# EAGLE board K104 (EAGLE 9.2.0), part 1 of 2
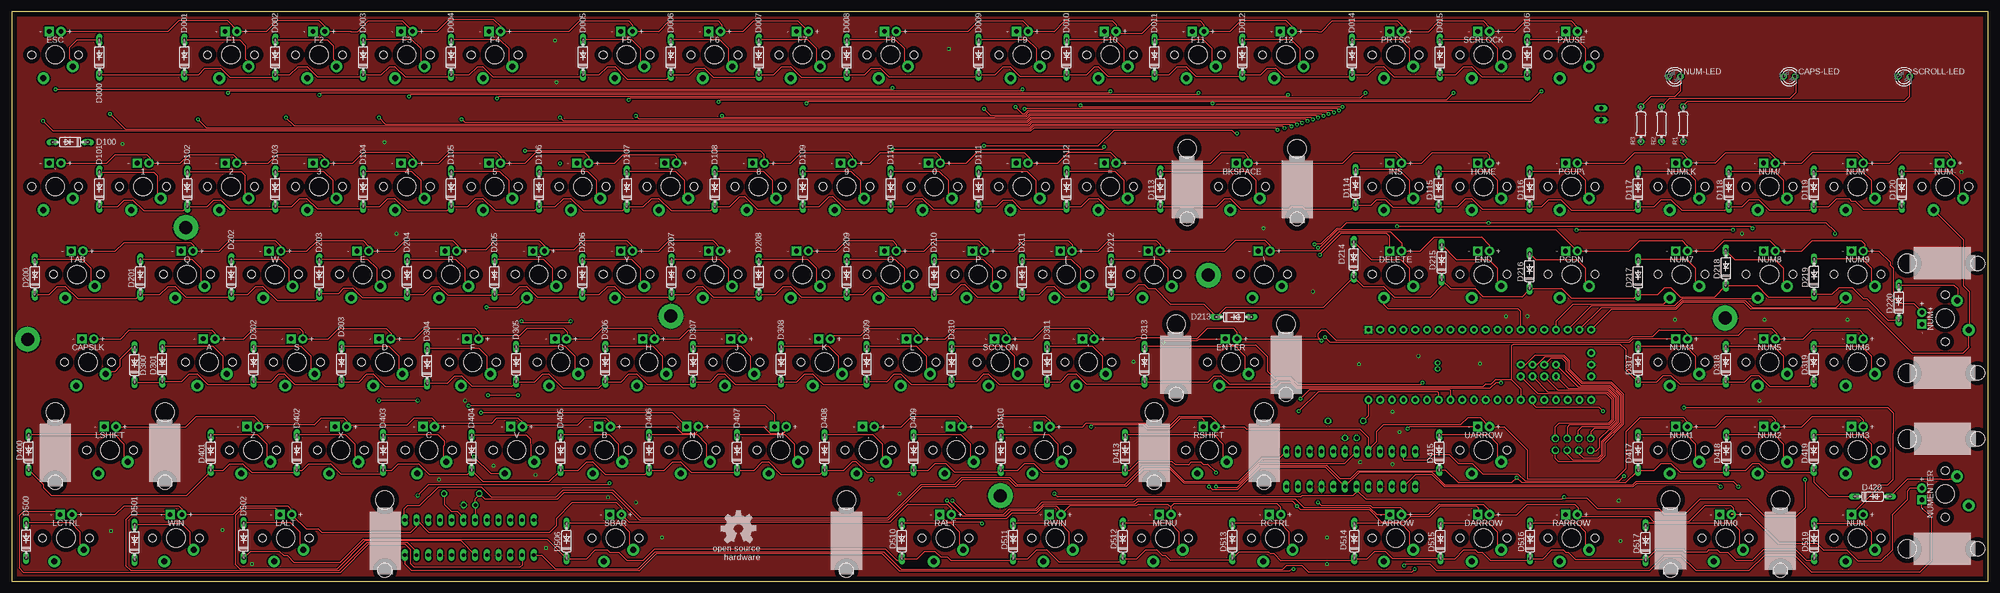
[diagram p2: board, top side]
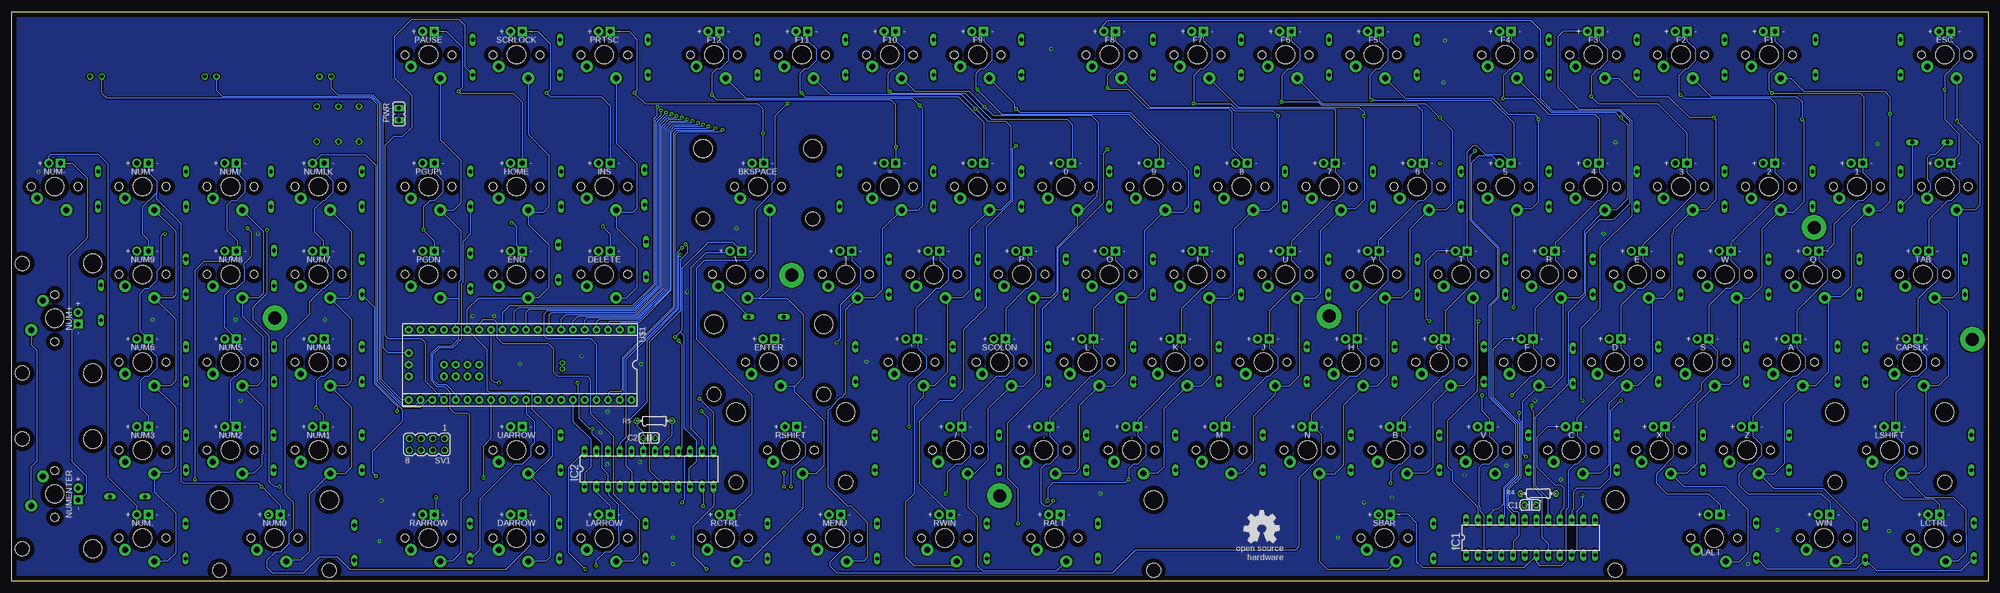
[diagram p3: board, bottom side, seen from below]

Size 428.35 x 123.59 mm. Coordinates in mm from the lower left corner, seen from the top.
Outline: 0,123.59 0,0 428.35,0 428.35,123.59 0,123.59
Copper layers (1*16): Top 0.035mm / dielectric 1.5mm / Bottom 0.035mm
Design rules "default": minimum track width 6mil, minimum drill 0.35mm, track to track 6mil, track to pad 6mil, pad to pad 6mil, via to via 6mil, smd to smd 6mil, copper to edge 40mil, drill to drill 6mil, minimum pad ring 10mil, minimum via ring 8mil, stop-mask expansion 4mil, vias tented up to drill 0mil, thermal gap 10mil
Net classes: 0 default: clearance 0.205 mm

## Footprints (pad centres in the part's own frame; a part is rotated, then mirrored left to right if it is on the bottom)
MX-1U-LED = drill 1 pad 2: LED+ -1.27,-5.08 | drill 1 pad 2 square: LED- 1.27,-5.08 | drill 1.3 pad 2.54: MX1 -3.81,2.54; MX2 2.54,5.08 | hole 4: 0,0 | hole 1.7: -5.08,0; 5.08,0
MX-2U-LED = drill 1 pad 2: LED+ -1.27,-5.08 | drill 1 pad 2 square: LED- 1.27,-5.08 | drill 1.3 pad 2.54: MX1 -3.81,2.54; MX2 2.54,5.08 | hole 4: 0,0; -11.9,-8.24; 11.9,-8.24 | hole 1.7: -5.08,0; 5.08,0 | hole 3.05: -11.9,7; 11.9,7
C025-024X044 = drill 0.813 octagon: 1 -1.27,0; 2 1.27,0
LED3MM = drill 0.813 octagon: A -1.27,0; K 1.27,0
DO35-7 = drill 0.813 long: A 3.81,0; C -3.81,0
2,8-PAD = drill 2.8 pad 5.334: B2,8 0,0
DIL24-3 = drill 0.813 long: 1 -13.97,-3.81; 2 -11.43,-3.81; 3 -8.89,-3.81; 4 -6.35,-3.81; 5 -3.81,-3.81; 6 -1.27,-3.81; 7 1.27,-3.81; 8 3.81,-3.81; 9 6.35,-3.81; 10 8.89,-3.81; 11 11.43,-3.81; 12 13.97,-3.81; 13 13.97,3.81; 14 11.43,3.81; 15 8.89,3.81; 16 6.35,3.81; 17 3.81,3.81; 18 1.27,3.81; 19 -1.27,3.81; 20 -3.81,3.81; 21 -6.35,3.81; 22 -8.89,3.81; 23 -11.43,3.81; 24 -13.97,3.81
JP1 = drill 0.914 long: 1 0,-1.27; 2 0,1.27
0204/7 = drill 0.813 octagon: 1 -3.81,0; 2 3.81,0
MX-6.25U-LED = drill 1 pad 2: LED+ -1.27,-5.08 | drill 1 pad 2 square: LED- 1.27,-5.08 | drill 1.3 pad 2.54: MX1 -3.81,2.54; MX2 2.54,5.08 | hole 4: 0,0; -50,-8.24; 50,-8.24 | hole 1.7: -5.08,0; 5.08,0 | hole 3.05: -50,7; 50,7
MA04-2 = drill 1.016 octagon: 1 -3.81,-1.27; 2 -3.81,1.27; 3 -1.27,-1.27; 4 -1.27,1.27; 5 1.27,-1.27; 6 1.27,1.27; 7 3.81,-1.27; 8 3.81,1.27
TEENSY2.0++ = drill 0.813 pad 1.676: 5V 24.13,-2.54; +5V -24.13,7.62; A0 8.89,2.54; A1 11.43,2.54; A2 13.97,2.54; A3 16.51,2.54; A4 8.89,0; A5 11.43,0; A6 13.97,0; A7 16.51,0; B0 -6.35,7.62; B1 -8.89,7.62; B2 -11.43,7.62; B3 -13.97,7.62; B4 -16.51,7.62; B5 -19.05,7.62; B6 -21.59,7.62; B7 -21.59,-7.62; C0 6.35,-7.62; C1 8.89,-7.62; C2 11.43,-7.62; C3 13.97,-7.62; C4 16.51,-7.62; C5 19.05,-7.62; C6 21.59,-7.62; C7 24.13,-7.62; D0 -19.05,-7.62; D1 -16.51,-7.62; D2 -13.97,-7.62; D3 -11.43,-7.62; D4 -8.89,-7.62; D5 -6.35,-7.62; D6 -3.81,-7.62; D7 -1.27,-7.62; E0 1.27,-7.62; E1 3.81,-7.62; E6 -1.27,7.62; E7 -3.81,7.62; F0 6.35,7.62; F1 8.89,7.62; F2 11.43,7.62; F3 13.97,7.62; F4 16.51,7.62; F5 19.05,7.62; F6 21.59,7.62; F7 24.13,7.62; GND2 24.13,0; GRND1 1.27,7.62; REF 3.81,7.62; RST 24.13,2.54 | drill 0.635 pad 1.067: E4 -9.144,0.914; E5 -9.144,-0.406 | drill 0.813 pad 1.676 square: GND -24.13,-7.62

## Placement (x,y rotation side)
0  KEYSWITCH-LED-MX-1U-LED  [MX-1U-LED]  199.95,85.62 180 top
1  KEYSWITCH-LED-MX-1U-LED  [MX-1U-LED]  28.5,85.62 180 top
2  KEYSWITCH-LED-MX-1U-LED  [MX-1U-LED]  47.55,85.62 180 top
3  KEYSWITCH-LED-MX-1U-LED  [MX-1U-LED]  66.6,85.62 180 top
4  KEYSWITCH-LED-MX-1U-LED  [MX-1U-LED]  85.65,85.62 180 top
5  KEYSWITCH-LED-MX-1U-LED  [MX-1U-LED]  104.7,85.62 180 top
6  KEYSWITCH-LED-MX-1U-LED  [MX-1U-LED]  123.75,85.62 180 top
7  KEYSWITCH-LED-MX-1U-LED  [MX-1U-LED]  142.8,85.62 180 top
8  KEYSWITCH-LED-MX-1U-LED  [MX-1U-LED]  161.85,85.62 180 top
9  KEYSWITCH-LED-MX-1U-LED  [MX-1U-LED]  180.9,85.62 180 top
'  KEYSWITCH-LED-MX-1U-LED  [MX-1U-LED]  233.3,47.52 180 top
,  KEYSWITCH-LED-MX-1U-LED  [MX-1U-LED]  185.65,28.47 180 top
-  KEYSWITCH-LED-MX-1U-LED  [MX-1U-LED]  218.97,85.62 180 top
.  KEYSWITCH-LED-MX-1U-LED  [MX-1U-LED]  204.7,28.47 180 top
/  KEYSWITCH-LED-MX-1U-LED  [MX-1U-LED]  223.75,28.47 180 top
=  KEYSWITCH-LED-MX-1U-LED  [MX-1U-LED]  238.05,85.62 180 top
[  KEYSWITCH-LED-MX-1U-LED  [MX-1U-LED]  228.52,66.57 180 top
\\  KEYSWITCH-LED-MX-1U-LED  [MX-1U-LED]  271.4,66.57 180 top
]  KEYSWITCH-LED-MX-1U-LED  [MX-1U-LED]  247.57,66.57 180 top
`  KEYSWITCH-LED-MX-1U-LED  [MX-1U-LED]  9.45,85.62 180 top
A  KEYSWITCH-LED-MX-1U-LED  [MX-1U-LED]  42.8,47.52 180 top
B  KEYSWITCH-LED-MX-1U-LED  [MX-1U-LED]  128.5,28.47 180 top
BKSPACE  KEYSWITCH-LED-MX-2U-LED  [MX-2U-LED]  266.62,85.62 180 top
C  KEYSWITCH-LED-MX-1U-LED  [MX-1U-LED]  90.4,28.47 180 top
C1  .1μF  [C025-024X044]  99.24,16.56 0 bottom
C2  .1μF  [C025-024X044]  290.19,31.11 0 bottom
CAPS-LED  Caps Lock  [LED3MM]  385.21,109.5 0 top
CAPSLK  KEYSWITCH-LED-MX-1U-LED  [MX-1U-LED]  16.56,47.52 180 top
D  KEYSWITCH-LED-MX-1U-LED  [MX-1U-LED]  80.9,47.52 180 top
D000  1N4148DO35-7  [DO35-7]  19.05,113.67 90 top
D001  1N4148DO35-7  [DO35-7]  37.47,113.67 90 top
D002  1N4148DO35-7  [DO35-7]  57.15,113.67 90 top
D003  1N4148DO35-7  [DO35-7]  76.2,113.67 90 top
D004  1N4148DO35-7  [DO35-7]  95.25,113.67 90 top
D005  1N4148DO35-7  [DO35-7]  123.83,113.67 90 top
D006  1N4148DO35-7  [DO35-7]  142.88,113.67 90 top
D007  1N4148DO35-7  [DO35-7]  161.93,113.67 90 top
D008  1N4148DO35-7  [DO35-7]  180.97,113.67 90 top
D009  1N4148DO35-7  [DO35-7]  209.55,113.67 90 top
D010  1N4148DO35-7  [DO35-7]  228.6,113.67 90 top
D011  1N4148DO35-7  [DO35-7]  247.65,113.67 90 top
D012  1N4148DO35-7  [DO35-7]  266.7,113.67 90 top
D014  1N4148DO35-7  [DO35-7]  290.45,113.67 90 top
D015  1N4148DO35-7  [DO35-7]  309.5,113.67 90 top
D016  1N4148DO35-7  [DO35-7]  328.42,113.67 90 top
D100  1N4148DO35-7  [DO35-7]  12.7,95.25 180 top
D101  1N4148DO35-7  [DO35-7]  19.05,85.09 90 top
D102  1N4148DO35-7  [DO35-7]  38.1,85.09 90 top
D103  1N4148DO35-7  [DO35-7]  57.15,85.09 90 top
D104  1N4148DO35-7  [DO35-7]  76.2,85.09 90 top
D105  1N4148DO35-7  [DO35-7]  95.25,85.09 90 top
D106  1N4148DO35-7  [DO35-7]  114.3,85.09 90 top
D107  1N4148DO35-7  [DO35-7]  133.35,85.09 90 top
D108  1N4148DO35-7  [DO35-7]  152.4,85.09 90 top
D109  1N4148DO35-7  [DO35-7]  171.45,85.09 90 top
D110  1N4148DO35-7  [DO35-7]  190.5,85.09 90 top
D111  1N4148DO35-7  [DO35-7]  209.55,85.09 90 top
D112  1N4148DO35-7  [DO35-7]  228.6,85.09 90 top
D113  1N4148DO35-7  [DO35-7]  248.92,85.09 90 top
D114  1N4148DO35-7  [DO35-7]  291.21,85.47 90 top
D115  1N4148DO35-7  [DO35-7]  309.25,85.09 90 top
D116  1N4148DO35-7  [DO35-7]  328.93,85.09 90 top
D117  1N4148DO35-7  [DO35-7]  352.43,85.09 90 top
D118  1N4148DO35-7  [DO35-7]  372.11,85.09 90 top
D119  1N4148DO35-7  [DO35-7]  390.52,85.09 90 top
D120  1N4148DO35-7  [DO35-7]  409.57,85.09 90 top
D200  1N4148DO35-7  [DO35-7]  5.08,66.04 90 top
D201  1N4148DO35-7  [DO35-7]  27.94,66.04 90 top
D202  1N4148DO35-7  [DO35-7]  47.62,66.04 90 top
D203  1N4148DO35-7  [DO35-7]  66.67,66.04 90 top
D204  1N4148DO35-7  [DO35-7]  85.72,66.04 90 top
D205  1N4148DO35-7  [DO35-7]  104.65,66.04 90 top
D206  1N4148DO35-7  [DO35-7]  123.7,66.04 90 top
D207  1N4148DO35-7  [DO35-7]  143,66.04 90 top
D208  1N4148DO35-7  [DO35-7]  161.93,66.04 90 top
D209  1N4148DO35-7  [DO35-7]  180.97,66.04 90 top
D210  1N4148DO35-7  [DO35-7]  199.9,66.04 90 top
D211  1N4148DO35-7  [DO35-7]  218.95,66.04 90 top
D212  1N4148DO35-7  [DO35-7]  238.25,66.04 90 top
D213  1N4148DO35-7  [DO35-7]  264.85,57.35 0 top
D214  1N4148DO35-7  [DO35-7]  290.83,69.85 90 top
D215  1N4148DO35-7  [DO35-7]  309.88,69.22 90 top
D216  1N4148DO35-7  [DO35-7]  328.93,67.31 90 top
D217  1N4148DO35-7  [DO35-7]  352.43,66.04 90 top
D218  1N4148DO35-7  [DO35-7]  371.48,67.94 90 top
D219  1N4148DO35-7  [DO35-7]  390.58,66.09 90 top
D220  1N4148DO35-7  [DO35-7]  408.94,60.45 90 top
D300  1N4148DO35-7  [DO35-7]  26.67,46.99 90 top
D301  1N4148DO35-7  [DO35-7]  32.66,47.14 90 top
D302  1N4148DO35-7  [DO35-7]  52.45,47.12 90 top
D303  1N4148DO35-7  [DO35-7]  71.5,47.12 90 top
D304  1N4148DO35-7  [DO35-7]  90.04,46.74 90 top
D305  1N4148DO35-7  [DO35-7]  109.35,47.12 90 top
D306  1N4148DO35-7  [DO35-7]  128.65,47.12 90 top
D307  1N4148DO35-7  [DO35-7]  147.7,47.12 90 top
D308  1N4148DO35-7  [DO35-7]  166.75,47.12 90 top
D309  1N4148DO35-7  [DO35-7]  185.29,47.12 90 top
D310  1N4148DO35-7  [DO35-7]  203.71,47.12 90 top
D311  1N4148DO35-7  [DO35-7]  224.41,47.12 90 top
D313  1N4148DO35-7  [DO35-7]  245.49,47.12 90 top
D317  1N4148DO35-7  [DO35-7]  352.43,47.12 90 top
D318  1N4148DO35-7  [DO35-7]  371.48,47.12 90 top
D319  1N4148DO35-7  [DO35-7]  390.52,47.12 90 top
D400  1N4148DO35-7  [DO35-7]  3.71,27.97 90 top
D401  1N4148DO35-7  [DO35-7]  43.18,27.94 90 top
D402  1N4148DO35-7  [DO35-7]  61.85,27.94 90 top
D403  1N4148DO35-7  [DO35-7]  80.52,27.94 90 top
D404  1N4148DO35-7  [DO35-7]  99.69,27.94 90 top
D405  1N4148DO35-7  [DO35-7]  118.97,27.94 90 top
D406  1N4148DO35-7  [DO35-7]  138.15,27.94 90 top
D407  1N4148DO35-7  [DO35-7]  157.23,27.94 90 top
D408  1N4148DO35-7  [DO35-7]  176.15,27.94 90 top
D409  1N4148DO35-7  [DO35-7]  195.45,27.94 90 top
D410  1N4148DO35-7  [DO35-7]  214.38,27.94 90 top
D413  1N4148DO35-7  [DO35-7]  241.3,27.94 90 top
D415  1N4148DO35-7  [DO35-7]  309.37,27.94 90 top
D417  1N4148DO35-7  [DO35-7]  352.43,27.94 90 top
D418  1N4148DO35-7  [DO35-7]  371.55,27.94 90 top
D419  1N4148DO35-7  [DO35-7]  390.52,27.94 90 top
D420  1N4148DO35-7  [DO35-7]  403.23,18.41 0 top
D500  1N4148DO35-7  [DO35-7]  3.17,8.89 90 top
D501  1N4148DO35-7  [DO35-7]  26.67,8.51 90 top
D502  1N4148DO35-7  [DO35-7]  50.29,8.89 90 top
D506  1N4148DO35-7  [DO35-7]  120.27,8.76 90 top
D510  1N4148DO35-7  [DO35-7]  192.91,8.76 90 top
D511  1N4148DO35-7  [DO35-7]  217.04,8.76 90 top
D512  1N4148DO35-7  [DO35-7]  240.79,8.76 90 top
D513  1N4148DO35-7  [DO35-7]  264.54,8.76 90 top
D514  1N4148DO35-7  [DO35-7]  290.96,8.76 90 top
D515  1N4148DO35-7  [DO35-7]  309.63,8.76 90 top
D516  1N4148DO35-7  [DO35-7]  329.06,8.76 90 top
D517  1N4148DO35-7  [DO35-7]  354.08,8.38 90 top
D519  1N4148DO35-7  [DO35-7]  390.6,8.76 90 top
DARROW  KEYSWITCH-LED-MX-1U-LED  [MX-1U-LED]  318.95,9.42 180 top
DELETE  KEYSWITCH-LED-MX-1U-LED  [MX-1U-LED]  299.9,66.57 180 top
E  KEYSWITCH-LED-MX-1U-LED  [MX-1U-LED]  76.12,66.57 180 top
END  KEYSWITCH-LED-MX-1U-LED  [MX-1U-LED]  318.95,66.57 180 top
ENTER  KEYSWITCH-LED-MX-2U-LED  [MX-2U-LED]  264.24,47.52 180 top
ESC  S001  [MX-1U-LED]  9.45,114.2 180 top
F  KEYSWITCH-LED-MX-1U-LED  [MX-1U-LED]  99.95,47.52 180 top
F1  KEYSWITCH-LED-MX-1U-LED  [MX-1U-LED]  47.55,114.2 180 top
F2  KEYSWITCH-LED-MX-1U-LED  [MX-1U-LED]  66.6,114.2 180 top
F3  KEYSWITCH-LED-MX-1U-LED  [MX-1U-LED]  85.65,114.2 180 top
F4  KEYSWITCH-LED-MX-1U-LED  [MX-1U-LED]  104.7,114.2 180 top
F5  KEYSWITCH-LED-MX-1U-LED  [MX-1U-LED]  133.27,114.2 180 top
F6  KEYSWITCH-LED-MX-1U-LED  [MX-1U-LED]  152.32,114.2 180 top
F7  KEYSWITCH-LED-MX-1U-LED  [MX-1U-LED]  171.37,114.2 180 top
F8  KEYSWITCH-LED-MX-1U-LED  [MX-1U-LED]  190.42,114.2 180 top
F9  KEYSWITCH-LED-MX-1U-LED  [MX-1U-LED]  219,114.2 180 top
F10  KEYSWITCH-LED-MX-1U-LED  [MX-1U-LED]  238.05,114.2 180 top
F11  KEYSWITCH-LED-MX-1U-LED  [MX-1U-LED]  257.1,114.2 180 top
F12  KEYSWITCH-LED-MX-1U-LED  [MX-1U-LED]  276.15,114.2 180 top
G  KEYSWITCH-LED-MX-1U-LED  [MX-1U-LED]  119,47.52 180 top
H  KEYSWITCH-LED-MX-1U-LED  [MX-1U-LED]  138.05,47.52 180 top
H1  MOUNT-PAD-ROUND2.8  [2,8-PAD]  3.48,52.5 0 top
H2  MOUNT-PAD-ROUND2.8  [2,8-PAD]  37.77,76.78 0 top
H3  MOUNT-PAD-ROUND2.8  [2,8-PAD]  142.88,57.53 0 top
H4  MOUNT-PAD-ROUND2.8  [2,8-PAD]  214.25,18.59 0 top
H5  MOUNT-PAD-ROUND2.8  [2,8-PAD]  259.31,66.42 0 top
H6  MOUNT-PAD-ROUND2.8  [2,8-PAD]  371.27,57.12 0 top
HOME  KEYSWITCH-LED-MX-1U-LED  [MX-1U-LED]  318.95,85.62 180 top
I  KEYSWITCH-LED-MX-1U-LED  [MX-1U-LED]  171.37,66.57 180 top
IC1  MAX7219CNG  [DIL24-3]  99.19,9.53 0 bottom
IC2  MAX7219CNG  [DIL24-3]  290.19,24.38 0 bottom
INS  KEYSWITCH-LED-MX-1U-LED  [MX-1U-LED]  299.9,85.62 180 top
J  KEYSWITCH-LED-MX-1U-LED  [MX-1U-LED]  157.1,47.52 180 top
K  KEYSWITCH-LED-MX-1U-LED  [MX-1U-LED]  176.15,47.52 180 top
L  KEYSWITCH-LED-MX-1U-LED  [MX-1U-LED]  195.2,47.52 180 top
LALT  KEYSWITCH-LED-MX-1U-LED  [MX-1U-LED]  59.44,9.42 180 top
LARROW  KEYSWITCH-LED-MX-1U-LED  [MX-1U-LED]  299.9,9.42 180 top
LCTRL  KEYSWITCH-LED-MX-1U-LED  [MX-1U-LED]  11.81,9.42 180 top
LSHIFT  KEYSWITCH-LED-MX-2U-LED  [MX-2U-LED]  21.36,28.47 180 top
M  KEYSWITCH-LED-MX-1U-LED  [MX-1U-LED]  166.6,28.47 180 top
MENU  KEYSWITCH-LED-MX-1U-LED  [MX-1U-LED]  249.94,9.42 180 top
N  KEYSWITCH-LED-MX-1U-LED  [MX-1U-LED]  147.55,28.47 180 top
NUM0  KEYSWITCH-LED-MX-2U-LED  [MX-2U-LED]  371.37,9.42 180 top
NUM1  KEYSWITCH-LED-MX-1U-LED  [MX-1U-LED]  361.85,28.47 180 top
NUM2  KEYSWITCH-LED-MX-1U-LED  [MX-1U-LED]  380.9,28.47 180 top
NUM3  KEYSWITCH-LED-MX-1U-LED  [MX-1U-LED]  399.95,28.47 180 top
NUM4  KEYSWITCH-LED-MX-1U-LED  [MX-1U-LED]  361.85,47.52 180 top
NUM5  KEYSWITCH-LED-MX-1U-LED  [MX-1U-LED]  380.9,47.52 180 top
NUM6  KEYSWITCH-LED-MX-1U-LED  [MX-1U-LED]  399.95,47.52 180 top
NUM7  KEYSWITCH-LED-MX-1U-LED  [MX-1U-LED]  361.85,66.57 180 top
NUM8  KEYSWITCH-LED-MX-1U-LED  [MX-1U-LED]  380.9,66.57 180 top
NUM9  KEYSWITCH-LED-MX-1U-LED  [MX-1U-LED]  399.95,66.57 180 top
NUM*  KEYSWITCH-LED-MX-1U-LED  [MX-1U-LED]  399.95,85.62 180 top
NUM+  KEYSWITCH-LED-MX-2U-LED  [MX-2U-LED]  419,57.07 270 top
NUM-  KEYSWITCH-LED-MX-1U-LED  [MX-1U-LED]  419,85.62 180 top
NUM-LED  Num Lock  [LED3MM]  360.36,109.5 0 top
NUM.  KEYSWITCH-LED-MX-1U-LED  [MX-1U-LED]  399.95,9.42 180 top
NUM/  KEYSWITCH-LED-MX-1U-LED  [MX-1U-LED]  380.9,85.62 180 top
NUMENTER  KEYSWITCH-LED-MX-2U-LED  [MX-2U-LED]  419,18.97 270 top
NUMLK  KEYSWITCH-LED-MX-1U-LED  [MX-1U-LED]  361.85,85.62 180 top
O  KEYSWITCH-LED-MX-1U-LED  [MX-1U-LED]  190.42,66.57 180 top
P  KEYSWITCH-LED-MX-1U-LED  [MX-1U-LED]  209.47,66.57 180 top
PAUSE  KEYSWITCH-LED-MX-1U-LED  [MX-1U-LED]  338,114.2 180 top
PGDN  KEYSWITCH-LED-MX-1U-LED  [MX-1U-LED]  338,66.57 180 top
PGUP\  KEYSWITCH-LED-MX-1U-LED  [MX-1U-LED]  338,85.62 180 top
PRTSC  KEYSWITCH-LED-MX-1U-LED  [MX-1U-LED]  299.9,114.2 180 top
PWR  [JP1]  344.42,101.35 0 bottom
Q  KEYSWITCH-LED-MX-1U-LED  [MX-1U-LED]  38.02,66.57 180 top
R  KEYSWITCH-LED-MX-1U-LED  [MX-1U-LED]  95.17,66.57 180 top
R1  100~Ω  [0204/7]  362.2,99.19 90 top
R2  100~Ω  [0204/7]  357.5,99.19 90 top
R3  100~Ω  [0204/7]  353.06,99.19 90 top
R4  9KΩ  [0204/7]  97.54,19.05 0 bottom
R5  9KΩ  [0204/7]  289.05,34.8 0 bottom
RALT  KEYSWITCH-LED-MX-1U-LED  [MX-1U-LED]  202.36,9.42 180 top
RARROW  KEYSWITCH-LED-MX-1U-LED  [MX-1U-LED]  338,9.42 180 top
RCTRL  KEYSWITCH-LED-MX-1U-LED  [MX-1U-LED]  273.76,9.42 180 top
RSHIFT  KEYSWITCH-LED-MX-2U-LED  [MX-2U-LED]  259.49,28.47 180 top
RWIN  KEYSWITCH-LED-MX-1U-LED  [MX-1U-LED]  226.14,9.42 180 top
S  KEYSWITCH-LED-MX-1U-LED  [MX-1U-LED]  61.85,47.52 180 top
SBAR  KEYSWITCH-LED-MX-6.25U-LED  [MX-6.25U-LED]  130.89,9.42 180 top
SCOLON  KEYSWITCH-LED-MX-1U-LED  [MX-1U-LED]  214.25,47.52 180 top
SCRLOCK  KEYSWITCH-LED-MX-1U-LED  [MX-1U-LED]  318.95,114.2 180 top
SCROLL-LED  Scroll Lock  [LED3MM]  410.05,109.5 0 top
SV1  [MA04-2]  338.33,29.72 180 bottom
T  KEYSWITCH-LED-MX-1U-LED  [MX-1U-LED]  114.22,66.57 180 top
TAB  KEYSWITCH-LED-MX-1U-LED  [MX-1U-LED]  14.2,66.57 180 top
U  KEYSWITCH-LED-MX-1U-LED  [MX-1U-LED]  152.32,66.57 180 top
U$1  TEENSY2.0++  [TEENSY2.0++]  318.13,46.99 180 bottom
U$2  [OSHW_8MM]  157.48,11.43 0 bottom
U$3  [OSHW_8MM]  157.48,11.43 0 top
UARROW  KEYSWITCH-LED-MX-1U-LED  [MX-1U-LED]  318.95,28.47 180 top
V  KEYSWITCH-LED-MX-1U-LED  [MX-1U-LED]  109.45,28.47 180 top
W  KEYSWITCH-LED-MX-1U-LED  [MX-1U-LED]  57.07,66.57 180 top
WIN  KEYSWITCH-LED-MX-1U-LED  [MX-1U-LED]  35.64,9.42 180 top
X  KEYSWITCH-LED-MX-1U-LED  [MX-1U-LED]  71.35,28.47 180 top
Y  KEYSWITCH-LED-MX-1U-LED  [MX-1U-LED]  133.27,66.57 180 top
Z  KEYSWITCH-LED-MX-1U-LED  [MX-1U-LED]  52.3,28.47 180 top

## Tracks (layer width: path | path; a pad name or v marks a point on that pad's centre or on a via)
A0
  Top 0.152: U$1.A0 330.71,40.77 345.57,40.77 346.71,39.62 346.71,35.05 345.95,34.29 335.28,34.29 334.52,33.53 SV1.1
A1
  Top 0.152: U$1.A1 332.89,41.12 345.71,41.12 347.07,39.77 347.07,36.6 347.09,36.58 347.07,36.55 347.07,34.9 346.07,33.91 337.57,33.91 337.06,33.4 SV1.3
A2
  Top 0.152: U$1.A2 335.07,41.48 345.86,41.48 347.45,39.9 347.45,34.78 346.22,33.55 340.26,33.55 339.47,32.77 339.47,31.11 SV1.5
A3
  Top 0.152: U$1.A3 337.26,41.84 346.01,41.84 347.81,40.05 347.81,34.63 346.37,33.19 342.95,33.19 342.14,32.38 SV1.7
A4
  Top 0.152: U$1.A4 327.98,46.99 330.09,49.1 336.34,49.1 337.52,47.92 337.52,46.13 340.38,43.27 346.6,43.27 349.24,40.64 349.24,34.04 345.19,29.99 345.19,27.18 343.91,25.91 335.28,25.91 334.52,26.67 SV1.2
A5
  Top 0.152: U$1.A5 330.52,46.99 332.28,48.74 336.19,48.74 337.16,47.77 337.16,45.98 340.23,42.91 346.45,42.91 348.88,40.49 348.88,34.19 344.81,30.11 344.81,27.31 343.79,26.29 338.33,26.29 337.06,27.56 SV1.4
A6
  Top 0.152: U$1.A6 333.5,48.39 336.04,48.39 336.8,47.62 336.8,45.72 339.97,42.55 346.31,42.55 348.52,40.34 348.52,34.34 344.42,30.24 344.42,27.43 343.66,26.67 340.61,26.67 339.6,27.69 SV1.6
A7
  Top 0.152: U$1.A7 339.44,42.2 346.16,42.2 348.16,40.19 348.16,34.48 346.52,32.84 346.02,32.84 344.04,30.86 344.04,28.96 343.28,28.19 342.39,28.19 SV1.8
B0  (via drill 0.35)
  Top 0.152: IC2.13 274.7,26.67 270.89,26.67 265.94,21.72 254.13,21.72 250.99,24.85 245.07,24.85 241.17,20.95 217.93,20.95 216.41,22.48 205.74,22.48 204.22,20.95 196.98,20.95 189.8,13.78 136.38,13.78 130.4,19.76 119.41,19.76 117.91,18.26 104.04,18.26 101.85,20.45 92.46,20.45 88.39,16.38 85.72,16.38 84.96,15.62 84.96,13.59 IC1.13 | U$1.B0 311.79,41.4 311.66,41.53 281.18,41.53 v279.27,39.62
  Bottom 0.152: IC2.13 276.23,36.58 v279.27,39.62
B1  (via drill 0.35)
  Top 0.152: IC1.12 85.22,3.81 86.74,2.29 136.02,2.29 139.72,5.99 188.65,5.99 192.46,2.18 276.88,2.18 277.37,2.67 v277.75,2.67 | U$1.B1 309.25,40.89 308.99,41.15 283.08,41.15 v278.89,36.96
  Bottom 0.152: v277.75,2.67 280.8,5.71 280.8,11.81 276.23,16.38 IC2.12 277.37,21.72 277.37,35.43 v278.89,36.96
B2
  Bottom 0.152: U$1.B2 306.7,34.67 302.89,30.86 302.89,24.77 304.17,23.5 IC2.1
B5  (via drill 0.35)
  Top 0.152: v275.84,98.3 275.46,98.68 221.35,98.68 220.63,97.96 24.72,97.96 v21.34,101.35
  Bottom 0.152: 1.MX2 26.2,80.3 | 26.2,80.3 29.72,76.78 29.72,64.01 32,61.72 35.26,61.72 Q.MX2 34.72,60.73 34.72,45.29 37.57,42.44 A.MX2 44.2,38.51 44.2,25.53 46.48,23.24 49.91,23.24 Z.MX2 46.56,20.19 35.81,20.19 28.57,12.95 28.57,5.33 30.1,3.81 32.56,3.81 WIN.MX2 | F1.MX2 42.82,109.12 40.01,106.3 22.48,106.3 21.34,105.16 v21.34,101.35 21.34,82.3 23.33,80.3 26.2,80.3 | v275.84,98.3 276.23,97.92 284.18,97.92 284.99,97.1 284.99,59.56 296.04,48.51 296.04,41.53 296.42,41.15 298.7,41.15 299.08,40.77 U$1.B5
B6  (via drill 0.35)
  Top 0.152: v274.32,97.92 273.94,98.3 221.47,98.3 220.78,97.61 9.07,97.61 v6.86,99.82
  Bottom 0.152: LCTRL.MX2 6.71,4.34 4.79,6.26 4.79,10.23 4.95,10.39 4.95,15.62 7.62,18.29 13.72,18.29 LSHIFT.MX2 15.09,23.39 13.64,24.84 13.64,42.06 CAPSLK.MX2 10.9,42.44 8.76,44.58 8.76,58.6 TAB.MX2 7.85,61.49 6.53,62.81 6.53,80.16 `.MX2 2.9,80.54 1.91,81.53 1.91,94.87 v6.86,99.82 6.86,109.07 ESC.MX2 | v274.32,97.92 274.7,97.54 283.9,97.54 284.61,96.83 284.61,59.44 295.66,48.39 295.66,40.77 296.55,39.88 U$1.B6
B7  (via drill 0.35)
  Top 0.152: v277.37,98.68 276.99,99.06 221.22,99.06 220.48,98.32 42.27,98.32 v40.39,100.2
  Bottom 0.152: LALT.MX2 56.74,4.19 54.1,4.19 52.2,6.1 52.2,15.62 57.15,20.57 65.99,20.57 X.MX2 65.38,23.39 63.25,25.53 63.25,38.51 S.MX2 59.08,42.67 56.01,42.67 54.15,44.53 54.15,61.34 | W.MX2 54.53,61.34 54.15,61.34 | 54.15,61.34 51.82,61.34 49.15,64.01 49.15,76.4 2.MX2 44.48,80.01 42.29,80.01 40.01,82.3 40.01,99.82 v40.39,100.2 40.39,104.01 41.53,105.16 60.1,105.16 F2.MX2 | v277.37,98.68 277.75,98.3 284.48,98.3 285.37,97.41 285.37,63.15 292.37,56.15 296.28,56.15 296.55,55.88 U$1.B7
C0  (via drill 0.35)
  Top 0.152: ENTER.MX2 262.08,42.06 273.97,42.06 275.05,43.14 277.22,43.14 278.45,41.91 320.42,41.91 321.56,43.05 v322.71,43.05
  Bottom 0.152: BKSPACE.MX2 264.08,63.58 266.32,61.34 | 266.32,61.34 268.71,61.34 \\.MX2 | 266.32,61.34 260.22,61.34 256.79,57.91 256.79,44.2 258.7,42.29 | 258.7,42.29 261.54,42.29 ENTER.MX2 | 258.7,42.29 258.7,41.15 252.22,34.67 252.22,25.15 253.97,23.39 RSHIFT.MX2 256.95,15.85 268.45,4.34 RCTRL.MX2 | U$1.C0 324.49,43.94 323.85,43.31 322.96,43.31 v322.71,43.05
C1
  Top 0.152: U$1.C1 327.02,58.55 326.52,59.05 298.32,59.05 297.36,60.02 DELETE.MX2
  Bottom 0.152: PRTSC.MX2 297.36,95.05 292.88,90.56 292.88,80.89 293.75,80.01 297.18,80.01 297.36,80.19 INS.MX2 297.36,76.76 292.88,72.28 292.88,63.74 295.27,61.34 297.2,61.34 DELETE.MX2 | U$1.C1 327.02,55.88 326.14,56.77 323.85,56.77 323.24,56.16 323.24,52.86 321.94,51.56 312.04,51.56 310.9,50.42 310.9,45.34 310.13,44.58 303.66,44.58 302.92,43.84 302.92,36.47 297.94,31.5 297.94,19.05 292.29,13.4 292.29,5.78 293.72,4.34 LARROW.MX2
C2
  Bottom 0.152: SCRLOCK.MX2 316.41,96.95 311.93,92.47 311.93,81.27 313.18,80.01 315.87,80.01 HOME.MX2 316.41,77.52 311.93,73.04 311.93,63.74 314.17,61.49 END.MX2 327.13,61.49 329.56,59.05 U$1.C2 325.37,50.42 325.37,41.53 324.99,41.15 316.23,41.15 315.6,40.51 315.6,37.47 311.16,33.03 311.16,27.16 314.94,23.39 UARROW.MX2 311.66,18.64 311.66,5.33 312.65,4.34 DARROW.MX2
C3
  Bottom 0.152: PAUSE.MX2 335.46,95.81 330.98,91.33 330.98,82.03 332.61,80.39 335.31,80.39 PGUP\.MX2 330.98,76.06 330.98,65.39 331.47,64.89 331.47,61.34 | RARROW.MX2 332.84,4.34 330.98,6.21 330.98,17.64 329.18,19.43 329.18,36.2 329.56,36.58 332.41,36.58 333.37,37.53 333.37,41.15 334.54,42.31 336.19,42.31 337.54,43.67 337.54,49.3 335.79,51.05 332.99,51.05 331.47,52.58 331.47,53.98 U$1.C3 332.3,54.8 332.3,55.56 331.47,56.39 331.47,61.34 | PGDN.MX2 335.31,61.34 331.47,61.34
C4
  Top 0.152: U$1.C4 334.64,56.52 338.33,60.2 358.01,60.2 NUM7.MX2
  Bottom 0.152: NUMLK.MX2 354.71,75.95 354.71,62.1 355.47,61.34 359.16,61.34 NUM7.MX2 354.71,56.9 354.71,43.43 355.7,42.44 NUM4.MX2 354.71,37.85 354.71,24.77 356.15,23.33 359.37,23.33 | NUM1.MX2 359.37,23.33 | 359.37,23.33 363.86,18.85 363.86,6.48 365.76,4.57 367.67,4.57 368.05,4.95 368.22,4.95 NUM0.MX2
C5
  Top 0.152: U$1.C5 342.39,59.82 360.43,59.82 361.95,61.34 378.21,61.34 NUM8.MX2
  Bottom 0.152: NUM/.MX2 373.76,75.95 373.76,62.48 374.75,61.49 NUM8.MX2 378.36,57.56 373.88,53.07 373.88,43.7 375.13,42.44 NUM5.MX2 373.88,37.96 373.88,27.67 374.14,27.4 374.14,25.15 375.89,23.39 NUM2.MX2
C6
  Top 0.152: U$1.C6 344.57,59.46 360.57,59.46 362.07,60.96 375.67,60.96 377.19,59.44 395.35,59.44 NUM9.MX2
  Bottom 0.152: NUM*.MX2 392.81,75.95 392.81,62.1 393.42,61.49 NUM9.MX2 392.81,56.9 392.81,43.43 393.8,42.44 NUM6.MX2 392.81,37.85 392.81,24.77 393.95,23.62 397.18,23.62 NUM3.MX2 397.41,19.46 392.81,14.86 392.81,6.1 394.56,4.34 NUM..MX2
C7
  Top 0.152: U$1.C7 346.76,59.1 360.72,59.1 362.2,60.58 375.29,60.58 376.81,59.05 402.34,59.05 411.86,49.53 422.91,49.53 424.18,50.8 424.08,50.9 NUM+.MX2 | NUM-.MX2 422.91,74.09 422.91,64.14 424.18,62.87 424.18,54.63 NUM+.MX2 | NUM+.MX2 423.53,53.98
  Bottom 0.152: NUM+.MX2 424.08,51.33 422.91,50.16 422.91,26.04 424.18,24.77 424.18,16.54 NUMENTER.MX2
D0  (via drill 0.35)
  Top 0.152: v278.51,99.06 278.13,99.44 221.1,99.44 220.38,98.73 81.58,98.73 81.53,98.68 61.34,98.68 v59.44,100.58
  Bottom 0.152: E.MX2 73.58,61.34 72.82,61.34 | 72.82,61.34 72.82,45.67 76.05,42.44 D.MX2 82.3,38.51 82.3,25.15 84.05,23.39 C.MX2 | F3.MX2 80.06,109.12 76.1,105.16 69.34,105.16 64.77,100.58 v59.44,100.58 59.05,100.2 59.05,82.68 61.19,80.54 3.MX2 68.3,76.3 68.3,75.55 68.58,75.27 68.58,63.25 70.48,61.34 72.82,61.34 | U$1.D0 299.08,56.01 298.59,56.51 292.51,56.51 285.77,63.24 285.77,97.67 284.76,98.68 278.89,98.68 v278.51,99.06
D1  (via drill 0.35)
  Top 0.152: v100.2,27.05 103.86,23.39 V.MX2 | v279.65,99.44 279.27,99.82 220.97,99.82 220.23,99.08 81.13,99.08 v79.63,100.58
  Bottom 0.152: F.MX2 97.55,42.3 | 97.55,42.3 100.97,38.89 100.97,27.81 v100.2,27.05 | F4.MX2 94.77,101.73 80.9,101.73 79.75,100.58 v79.63,100.58 78.11,99.06 78.11,83.06 80.62,80.54 4.MX2 87.63,76.02 87.63,62.48 88.62,61.49 R.MX2 92.25,61.11 92.25,44.53 94.68,42.1 97.35,42.1 97.55,42.3 | U$1.D1 301.62,56.13 300.9,56.86 292.66,56.86 286.18,63.34 286.18,97.92 285.04,99.06 280.04,99.06 v279.65,99.44
D2  (via drill 0.35)
  Top 0.152: v102.87,59.44 109.63,59.44 T.MX2 | v280.8,99.82 280.42,100.2 220.85,100.2 220.11,99.47 120.04,99.47 120.02,99.44 98.3,99.44 v97.54,100.2
  Bottom 0.152: F5.MX2 126.39,104.78 107.44,104.78 104.01,101.35 98.3,101.35 97.68,100.72 97.68,100.34 v97.54,100.2 97.54,82.3 99.06,80.77 101.78,80.77 102.16,80.39 5.MX2 102.16,79.58 102.87,78.87 v102.87,59.44 | T.MX2 111.3,61.11 111.3,44.91 113.77,42.44 G.MX2 120.4,38.51 120.4,24.77 121.77,23.39 B.MX2 | v280.8,99.82 281.18,99.44 285.39,99.44 286.59,98.24 286.59,63.44 292.81,57.22 303.59,57.22 304.17,56.64 U$1.D2
D3  (via drill 0.35)
  Top 0.152: v281.94,100.2 281.56,100.58 220.72,100.58 219.99,99.85 136.42,99.85 136.4,99.82 119.63,99.82 v118.87,100.58
  Bottom 0.152: 6.MX2 121.26,80.49 | 121.26,80.49 125.35,76.4 125.35,63.25 127.1,61.49 Y.MX2 130.35,61.11 130.35,44.53 132.57,42.3 135.65,42.3 H.MX2 139.83,38.12 139.83,25.15 141.73,23.24 145.01,23.24 | F6.MX2 144.3,103.63 121.92,103.63 v118.87,100.58 116.2,97.92 116.2,81.92 117.63,80.49 121.26,80.49 | U$1.D3 306.7,56.39 305.51,57.58 292.96,57.58 287,63.54 287,98.47 285.64,99.82 282.32,99.82 v281.94,100.2 | N.MX2 145.01,23.24 | 145.01,23.24 145.01,4.42 143.26,2.67 130.02,2.67 SBAR.MX2
D4  (via drill 0.35)
  Top 0.152: v283.08,100.58 282.7,100.97 220.6,100.97 219.84,100.2 136.02,100.2 v135.25,100.97
  Bottom 0.152: F7.MX2 162.59,102.87 136.4,102.87 135.25,101.73 v135.25,100.97 135.25,82.68 137.16,80.77 140.03,80.77 7.MX2 144.78,76.02 144.78,62.48 145.92,61.34 149.78,61.34 U.MX2 149.35,61.06 149.35,44.58 151.64,42.29 154.56,42.29 | J.MX2 154.56,42.29 | 154.56,42.29 154.56,40.51 159.26,35.81 159.26,25.91 161.77,23.39 M.MX2 | U$1.D4 309.25,56.9 308.2,57.94 293.11,57.94 287.39,63.65 287.39,98.75 285.94,100.2 283.46,100.2 v283.08,100.58
D5  (via drill 0.35)
  Top 0.152: v284.23,100.97 283.85,101.35 220.47,101.35 219.75,100.63 213.03,100.63 212.98,100.58 154.31,100.58 v153.92,100.97
  Bottom 0.152: K.MX2 173.75,42.3 | 173.75,42.3 178.69,37.36 178.69,29.34 178.63,29.28 178.63,27.67 178.69,27.61 178.69,24.77 180.06,23.39 ,.MX2 | 173.75,42.3 170.68,42.3 168.45,44.53 168.45,61.11 I.MX2 168.99,61.34 164.59,61.34 163.45,62.48 163.45,76.4 8.MX2 159.36,80.49 159.26,80.39 155.83,80.39 153.92,82.3 v153.92,100.97 155.07,102.11 163.45,102.11 164.21,102.87 181.63,102.87 F8.MX2 | U$1.D5 311.79,57.78 311.28,58.29 293.25,58.29 287.75,63.8 287.75,99.09 286.26,100.58 284.61,100.58 v284.23,100.97
D6  (via drill 0.35)
  Top 0.152: v285.37,101.35 284.99,101.73 220.34,101.73 219.6,100.99 212.19,100.99 v210.69,102.49
  Bottom 0.152: v285.37,101.35 285.75,100.97 286.54,100.97 288.11,99.4 288.11,63.95 293.31,58.74 312.22,58.74 313.06,57.91 313.06,53.34 312.42,52.7 302.89,52.7 301.62,51.44 U$1.B4 | F9.MX2 211.07,103.73 211.07,102.87 v210.69,102.49 209.93,101.73 185.93,101.73 173.35,89.15 173.35,81.15 174.5,80.01 177.82,80.01 9.MX2 182.88,76.02 182.88,63.25 184.63,61.49 O.MX2 187.07,60.68 187.07,44.96 189.72,42.3 192.8,42.3 | L.MX2 192.8,42.3 | 192.8,42.3 196.98,38.12 196.98,24.38 197.97,23.39 ..MX2
D7  (via drill 0.35)
  Top 0.152: v286.51,101.73 286.13,102.11 220.22,102.11 219.46,101.35 219.07,101.35 v217.55,102.87
  Bottom 0.152: 0.MX2 197.41,80.39 | 197.41,80.39 197.41,76.91 201.93,72.39 201.93,62.87 203.3,61.49 P.MX2 206.55,61.11 206.55,44.91 209.16,42.3 211.85,42.3 | F10.MX2 232.67,106.28 220.83,106.28 217.55,102.99 v217.55,102.87 217.43,102.87 215.52,100.97 194.31,100.97 192.93,99.58 192.93,84.82 193.17,84.58 193.17,83.44 196.22,80.39 197.41,80.39 | U$1.D7 316.87,58.42 316.18,59.1 293.45,59.1 288.46,64.09 288.46,99.69 286.51,101.65 v286.51,101.73 | /.MX2 221.21,23.24 | 221.21,23.24 221.21,16.23 219.07,14.1 219.07,3.43 217.93,2.29 201.88,2.29 RALT.MX2 | SCOLON.MX2 211.85,42.3 | 211.85,42.3 216.79,37.36 216.79,29.34 216.73,29.28 216.73,27.67 216.79,27.61 216.79,26.29 219.84,23.24 221.21,23.24
E0  (via drill 0.35)
  Top 0.152: v287.65,102.11 287.27,102.49 v219.46,102.49
  Bottom 0.152: F11.MX2 250.95,105.51 222.48,105.51 v219.46,102.49 216.79,99.82 212.98,99.82 211.84,98.68 211.84,82.68 213.97,80.54 -.MX2 220.6,76.38 220.6,63.25 222.35,61.49 [.MX2 225.6,61.11 225.6,45.29 228.45,42.44 '.MX2 230.76,40.13 232.79,38.1 232.79,19.05 234.7,17.14 234.7,5.33 232.79,3.43 224.41,3.43 224.41,3.53 RWIN.MX2 | U$1.E0 319.4,58.55 318.49,59.46 293.6,59.46 288.82,64.24 288.82,99.98 287.65,101.14 v287.65,102.11
E1  (via drill 0.35)
  Top 0.152: v288.42,102.87 232.03,102.87 v231.65,103.25
  Bottom 0.152: F12.MX2 269.26,104.78 233.17,104.78 v231.65,103.25 230.89,102.49 230.89,81.53 232.03,80.39 235.36,80.39 =.MX2 239.65,76.4 239.65,63.25 241.4,61.49 ].MX2 247.65,58.88 247.65,40.77 248.61,39.81 248.87,39.81 250.68,37.99 250.68,37.74 251.46,36.96 251.46,20.57 247.27,16.38 246.51,16.38 242.91,12.79 242.91,5.12 243.69,4.34 MENU.MX2 | U$1.E1 321.94,58.29 320.42,59.82 293.75,59.82 289.18,64.39 289.18,100.36 288.42,101.12 v288.42,102.87
E6
  Top 0.152: D502.C 51.69,6.48 58.14,6.48 59.04,5.57 59.82,5.57 61.2,4.19 71.25,4.19 76.2,9.14 116.08,9.14 D506.C 124.59,4.95 126.49,6.86 129.08,6.86 129.6,6.33 131.59,6.33 133.35,4.57 136.88,4.57 139.25,6.95 189.42,6.95 191.8,4.57 192.79,4.57 193.17,4.95 | D510.C 193.17,4.95 | 193.17,4.95 196.22,4.95 197.74,6.48 200.17,6.48 201.46,5.19 202.84,5.19 203.45,4.57 216.66,4.57 D511.C 220.22,4.95 222.12,6.86 224.33,6.86 227,4.19 240.03,4.19 D512.C 243.84,4.95 245.75,6.86 248.13,6.86 249.42,5.57 250.08,5.57 251.08,4.57 264.16,4.57 D513.C 266.06,6.48 272.33,6.48 272.86,5.95 273.62,5.95 275.05,4.52 290.53,4.52 D514.C 293.75,4.95 295.27,6.48 297.71,6.48 299.23,4.95 D515.C 312.8,4.95 314.71,6.86 317.14,6.86 317.67,6.33 318.66,6.33 320.42,4.57 328.68,4.57 D516.C 331.85,4.95 333.76,6.86 336.19,6.86 336.72,6.33 337.33,6.33 338.84,4.83 353.82,4.83 D517.C 356.36,6.86 362.2,6.86 362.71,6.35 367.28,6.35 367.79,6.86 369.57,6.86 370.09,6.33 371.86,6.33 373.62,4.57 377.28,4.57 379.52,6.82 386.64,6.82 388.89,4.57 390.22,4.57 D519.C
  Bottom 0.152: D500.C 5.97,2.29 24.26,2.29 D501.C 28.7,2.67 47.88,2.67 D502.C | U$1.E6 316.87,36.45 315.09,34.67 315.09,30 315.81,29.28 315.81,27.24 317.67,25.38 319.28,25.38 326.9,17.76 326.9,6.86 328.8,4.95 D516.C
F0  (via drill 0.35)
  Top 0.152: 81.15,24.13 D403.C | 81.15,24.13 82.42,24.13 83.82,25.53 88.21,25.53 90.5,23.24 98.81,23.24 D404.C 102.11,21.72 116.56,21.72 D405.C 122.81,24.13 124.59,25.91 125.93,25.91 128.6,23.24 137.26,23.24 D406.C 141.48,24.13 143.26,25.91 144.98,25.91 147.26,23.62 156.72,23.62 D407.C 160.91,24.13 162.69,25.91 164.03,25.91 166.7,23.24 175.26,23.24 D408.C 180.34,24.13 182.12,25.91 183.08,25.91 185.37,23.62 194.94,23.62 D409.C 198.63,24.13 200.03,25.53 202.51,25.53 204.41,23.62 213.87,23.62 D410.C 218.06,24.13 219.46,25.53 221.56,25.53 223.47,23.62 240.79,23.62 D413.C 242.32,24.13 244.16,25.97 251.52,25.97 252.22,25.27 255.02,25.27 255.65,25.91 257.68,25.91 258.21,25.38 259.23,25.38 v260.99,23.62 | 81.15,24.13 80.26,23.24 71.45,23.24 69.16,25.53 64.39,25.53 62.99,24.13 D402.C 61.34,23.62 52.02,23.62 50.11,25.53 47.24,25.53 45.85,24.13 43.43,24.13 | D401.C 43.43,24.13 | D400.C 6.84,21.02 6.84,20.39 8.56,18.67 37.97,18.67 43.43,24.13 | v260.99,20.57 261.3,20.25 265.5,20.25 270.36,25.12 285.01,25.12 287.78,22.35 290.2,22.35 291.82,23.98 309.22,23.98 D415.C 310.77,24.13 313.56,21.34 324.99,21.34 v326.14,22.48 327.28,21.34 349.63,21.34 D417.C 355.98,24.13 357.38,25.53 359.66,25.53 361.56,23.62 371.04,23.62 D418.C 375.79,24.13 377.19,25.53 378.71,25.53 380.62,23.62 390.02,23.62 D419.C 390.52,21.59 393.7,18.41 D420.C
  Bottom 0.152: U$1.F0 324.49,30.99 326.14,29.34 v326.14,22.48 | v260.99,23.62 v260.99,20.57
F1
  Top 0.152: D300.C 32.51,43.18 D301.C 36.85,43.33 38.48,44.96 40.23,44.96 42.52,42.67 51.82,42.67 D302.C 56.26,43.31 57.91,44.96 59.05,44.96 61.34,42.67 70.87,42.67 D303.C 75.31,43.31 76.96,44.96 78.33,44.96 81,42.29 89.41,42.29 D304.C 94.36,42.93 96.01,44.58 97.54,44.58 99.82,42.29 108.33,42.29 D305.C 113.41,43.31 115.06,44.96 116.43,44.96 119.48,41.91 127.25,41.91 D306.C 132.08,43.31 133.73,44.96 135.48,44.96 137.76,42.67 147.07,42.67 D307.C 151.51,43.31 153.16,44.96 154.53,44.96 156.81,42.67 166.12,42.67 D308.C 170.18,43.31 171.83,44.96 173.58,44.96 175.87,42.67 184.66,42.67 D309.C 189.61,43.31 191.26,44.96 192.63,44.96 194.91,42.67 203.07,42.67 203.64,43.24 D310.C 209.04,43.31 210.69,44.96 211.68,44.96 213.97,42.67 223.77,42.67 D311.C 227.33,43.31 228.98,44.96 230.73,44.96 233.01,42.67 244.86,42.67 D313.C 259.33,43.31 260.6,44.58 262.05,44.58 263.95,42.67 273.18,42.67 274.32,43.81 277.05,43.81 278.54,42.32 318.93,42.32 319.47,42.86 320.61,42.86 321.56,43.81 324.99,43.81 | D319.C 389.51,42.29 381,42.29 378.71,44.58 376.81,44.58 375.54,43.31 D318.C 370.84,42.67 361.56,42.67 359.66,44.58 357.76,44.58 356.49,43.31 D317.C 349.76,45.97 349.76,50.29 348.62,51.44 325.37,51.44 324.99,51.05 324.99,43.81 | U$1.F1 327.02,41.78 324.99,43.81
F2  (via drill 0.35)
  Top 0.152: D200.C 8.13,62.23 9.91,64.01 11.63,64.01 14.3,61.34 27.05,61.34 D201.C 32.13,62.23 33.91,64.01 35.43,64.01 37.72,61.72 47.12,61.72 D202.C 51.18,62.23 52.96,64.01 54.48,64.01 57.53,60.96 65.91,60.96 67.06,62.1 66.93,62.23 D203.C 66.93,62.48 70.87,62.48 72.01,63.63 73.94,63.63 76.09,61.47 84.96,61.47 D204.C 89.28,62.23 91.06,64.01 92.6,64.01 94.51,62.1 104.52,62.1 D205.C 108.33,62.23 110.11,64.01 111.65,64.01 113.94,61.72 123.19,61.72 D206.C 127.38,62.23 129.16,64.01 130.68,64.01 132.97,61.72 142.49,61.72 D207.C 146.81,62.23 148.59,64.01 149.75,64.01 152.04,61.72 161.42,61.72 D208.C 165.48,62.23 167.26,64.01 168.8,64.01 171.09,61.72 180.47,61.72 D209.C 184.53,62.23 186.31,64.01 187.83,64.01 190.12,61.72 199.39,61.72 D210.C 203.58,62.23 205.74,64.39 206.52,64.39 209.19,61.72 218.44,61.72 D211.C 222.63,62.23 224.41,64.01 225.95,64.01 228.24,61.72 237.74,61.72 D212.C 242.06,62.23 244.22,64.39 245.38,64.39 246.29,63.48 247.8,63.48 251.08,60.2 258.32,60.2 261.04,57.48 D213.C 263.12,59.44 284.23,59.44 D214.C 292.86,64.01 297.33,64.01 299.61,61.72 307.47,61.72 309.88,64.14 D215.C 311.8,63.48 317.14,63.48 318.9,61.72 327.28,61.72 328.93,63.37 D216.C 335.94,63.5 338.1,61.34 351.54,61.34 D217.C 356.74,62.23 358.14,63.63 359.66,63.63 361.56,61.72 369.06,61.72 D218.C 378.2,64.14 380.62,61.72 390.02,61.72 D219.C 394.51,62.28 395.86,63.63 398.9,63.63 401.33,61.2 402.1,61.2 406.65,56.64 D220.C | v344.81,36.96 344.04,37.72 330.33,37.72 329.56,38.48 U$1.F2
  Bottom 0.152: D217.C 349.73,59.54 349.73,42.91 344.81,37.98 v344.81,36.96
F3
  Top 0.152: D101.C 22.99,81.28 24.38,82.68 26.31,82.68 28.6,80.39 37.21,80.39 D102.C 42.42,81.28 43.81,82.68 45.36,82.68 47.27,80.77 57.53,80.77 57.53,80.9 D103.C 60.71,81.28 62.48,83.06 64.01,83.06 66.29,80.77 75.69,80.77 D104.C 79.76,81.28 81.53,83.06 83.08,83.06 85.75,80.39 94.36,80.39 D105.C 98.81,81.28 100.58,83.06 102.11,83.06 104.78,80.39 113.41,80.39 D106.C 117.86,81.28 119.63,83.06 121.18,83.06 123.85,80.39 132.46,80.39 D107.C 136.91,81.28 138.68,83.06 140.23,83.06 142.9,80.39 151.51,80.39 D108.C 155.57,81.28 157.73,83.44 158.88,83.44 161.54,80.77 170.94,80.77 D109.C 175.01,81.28 177.16,83.44 177.95,83.44 180.62,80.77 189.99,80.77 D110.C 194.06,81.28 195.83,83.06 197.38,83.06 199.66,80.77 209.04,80.77 D111.C 213.49,81.28 214.88,82.68 216.78,82.68 218.69,80.77 228.09,80.77 D112.C 231.78,81.28 233.55,83.06 235.48,83.06 237.76,80.77 248.41,80.77 D113.C 261.11,81.28 262.89,83.06 264.05,83.06 266.34,80.77 276.97,80.77 277.44,81.24 279.61,81.24 280.08,80.77 290.32,80.77 D114.C 294.64,81.66 295.66,82.68 297.71,82.68 299.23,81.15 309.12,81.15 D115.C 313.31,81.28 315.09,83.06 316.38,83.06 318.66,80.77 328.42,80.77 D116.C 331.6,81.28 332.99,82.68 335.81,82.68 338.1,80.39 351.54,80.39 D117.C 355.98,81.28 357.38,82.68 359.66,82.68 361.95,80.39 371.22,80.39 D118.C 375.03,81.28 376.43,82.68 378.71,82.68 381,80.39 389.64,80.39 D119.C 393.7,81.28 395.48,83.06 398.14,83.06 398.67,82.53 399.43,82.53 401.19,80.77 409.07,80.77 D120.C
  Bottom 0.152: D100.C 16.51,83.82 D101.C | D116.C 328.93,75.31 330.62,73.62 330.62,64.86 330.86,64.62 330.86,52.58 332.76,50.67 335.66,50.67 337.19,49.15 337.19,43.81 336.04,42.67 334.14,42.67 331.85,40.39 331.85,39.62 U$1.F3
F4
  Top 0.152: D000.C D001.C 40.51,109.86 41.91,111.25 45.34,111.25 47.24,109.35 56.64,109.35 D002.C 60.33,109.86 62.1,111.63 64.03,111.63 66.31,109.35 75.69,109.35 D003.C 80.14,109.86 81.92,111.63 83.08,111.63 85.36,109.35 94.74,109.35 D004.C 99.19,109.86 100.97,111.63 102.13,111.63 104.42,109.35 123.32,109.35 D005.C 127.38,109.86 129.16,111.63 130.78,111.63 133.45,108.97 141.99,108.97 D006.C 146.81,109.86 148.21,111.25 150.13,111.25 152.04,109.35 161.42,109.35 D007.C 165.1,109.86 166.88,111.63 168.8,111.63 171.09,109.35 180.47,109.35 D008.C 184.91,109.86 186.31,111.25 188.24,111.25 190.14,109.35 209.04,109.35 D009.C 213.11,109.86 214.88,111.63 216.43,111.63 218.59,109.47 228.22,109.47 D010.C 232.92,109.86 234.7,111.63 235.48,111.63 237.64,109.47 247.27,109.47 D011.C 250.82,109.86 252.6,111.63 254.53,111.63 256.69,109.47 266.32,109.47 D012.C 270.64,109.86 272.03,111.25 273.96,111.25 275.87,109.35 289.94,109.35 D014.C 293.88,109.86 295.66,111.63 297.33,111.63 299.61,109.35 308.99,109.35 D015.C 312.93,109.86 314.71,111.63 316.38,111.63 318.66,109.35 327.91,109.35 D016.C
  Bottom 0.152: U$1.F4 338.71,43.43 338.71,51.82 339.47,52.58 346.58,52.58 347.35,53.34 347.35,94.61 345.44,96.52 343.54,96.52 341.63,98.42 341.63,105.41 345.44,109.22 345.44,118.11 341.63,121.92 331.47,121.92 330.2,120.65 330.2,111.63 D016.C
F5
  Bottom 0.152: U$1.F5 338.14,39.37 339.77,37.74 343.43,37.74 348.97,43.29 348.97,103.43 350.31,104.78 407.67,104.78 408.78,105.89 SCROLL-LED.A
F6
  Bottom 0.152: U$1.F6 341,38.1 343.28,38.1 348.62,43.43 348.62,103.58 350.17,105.13 382.63,105.13 383.94,106.44 CAPS-LED.A
F7
  Bottom 0.152: U$1.F7 343.79,39.37 348.23,43.81 348.23,103.5 348.26,103.53 348.26,103.73 350.02,105.49 357.58,105.49 359.11,107.01 NUM-LED.A
GND  (via drill 0.35)
  other vias: 118.11,108.2 117.73,117.35 318.13,47.24 203.07,115.44 80.77,95.25 284.99,9.53 243.08,47.62 292.23,25.91 348.23,17.53 271.27,76.58 83.44,75.44 378.71,39.24 360.43,56.77 379.86,56.77 397.76,56.77 374.9,75.44 291.97,47.12 323.85,57.53 24,94.87 348.62,8.76 98.3,39.24 422.53,88.77 299.21,36.83 300.74,32.38 115.82,7.24 140.97,9.53 284.99,3.81 328.42,57.53 92.58,22.1 104.39,25.15 281.94,62.87 113.54,23.11 21.59,10.92 45.72,11.18 52.07,3.81 299.21,25.4 135.25,17.14 192.41,19.05 304.8,48.9 129.24,18.24
  pour Top (isolate 0.305): 0,123.59 0,0 428.35,0 428.35,123.59
  pour Bottom (isolate 0.305): 0,123.59 0,0 428.35,0 428.35,123.59
IC1-2  (via drill 0.35)
  Top 0.152: v190.88,107.06 190.5,106.68 v9.53,106.68 | LCTRL.LED- 9.8,15.24 2.67,15.24 1.65,14.22 1.65,2.92 2.67,1.91 71.25,1.91 77.34,8 85.34,8 86.49,6.86 86.49,3.81 87.25,3.05 110.11,3.05 110.62,3.56 IC1.2
  Bottom 0.152: ESC.LED- 8.18,117.3 6.36,115.48 6.36,112.9 9.53,109.73 v9.53,106.68 9.53,100.2 6.48,97.16 6.48,92.41 `.LED- 8.18,88.73 6.36,86.9 6.36,84.34 8.17,82.53 8.91,82.53 12.95,78.49 12.95,71.68 TAB.LED- 12.93,69.68 11.11,67.85 11.11,65.29 12.92,63.48 13.1,63.48 15.29,61.29 CAPSLK.LED- 15.29,50.63 13.47,48.8 13.47,46.24 15.28,44.43 16.53,44.43 20.09,40.87 LSHIFT.LED- 20.09,31.58 18.27,29.75 18.27,27.19 20.08,25.38 20.34,25.38 22.48,23.24 22.48,21.72 18.67,17.91 11.81,17.91 10.67,16.76 10.67,14.63 LCTRL.LED- | F8.LED- 189.15,117.3 187.33,115.48 187.33,112.92 189.14,111.11 189.5,111.11 190.88,109.73 v190.88,107.06 190.5,106.68 186.31,106.68 182.12,102.49 164.59,102.49 163.83,101.73 163.83,93.95 8.LED-
IC1-3  (via drill 0.35)
  Top 0.152: v276.61,105.54 276.23,105.16 105.54,105.16 v105.16,104.78 | v109.73,40.39 v103.25,40.39 | v190.88,93.73 236.4,93.73 236.73,94.06 v236.73,94.23 | RALT.LED- 202.64,12.95 209.93,12.95 v210.31,12.57
  Bottom 0.152: IC1.3 109.35,6.99 109.35,14.48 110.26,15.39 110.26,16.28 110.49,16.51 110.49,24.62 109.73,25.38 108.17,25.38 106.36,27.19 106.36,29.75 108.18,31.58 V.LED- 108.18,35.41 109.73,36.96 v109.73,40.39 | F12.LED- 274.88,117.3 273.06,115.48 273.06,112.92 274.87,111.11 275.61,111.11 276.61,110.11 v276.61,105.54 275.46,104.39 237.74,104.39 236.73,103.38 v236.73,94.23 236.73,90.81 236.8,90.73 =.LED- | F4.LED- 103.43,117.3 101.61,115.48 101.61,112.92 103.42,111.11 103.78,111.11 105.16,109.73 v105.16,104.78 98.68,104.78 95.25,101.35 85.34,101.35 84.38,100.38 4.LED- 84.38,88.73 82.56,86.9 82.56,84.34 84.37,82.53 84.73,82.53 93.9,73.36 R.LED- 93.9,69.68 92.08,67.85 92.08,65.27 98.3,59.05 98.3,52.98 F.LED- 98.68,50.63 96.86,48.8 96.86,46.24 98.67,44.43 99.21,44.43 v103.25,40.39 | v190.88,93.73 191.81,92.8 191.81,82.01 201.55,72.27 201.55,62.48 204.98,59.05 204.98,41.91 212.6,34.29 212.6,22.48 210.31,20.19 v210.31,12.57
IC1-5  (via drill 0.35)
  Top 0.152: v153.16,104.01 153.54,104.39 310.9,104.39 v312.42,105.92 | N.LED- 143.26,36.58 v101.73,36.58
  Bottom 0.152: F6.LED- 151.05,117.3 149.23,115.48 149.23,112.92 151.04,111.11 151.78,111.11 153.16,109.73 v153.16,104.01 145.18,104.01 144.44,103.28 123.85,103.28 122.68,102.11 122.68,90.91 6.LED- 122.48,88.73 120.66,86.9 120.66,84.34 122.47,82.53 123.59,82.53 132.21,73.91 132.21,71.86 Y.LED- 132,69.68 130.18,67.85 130.18,65.27 136.78,58.67 H.LED- 136.78,50.63 134.96,48.8 134.96,46.24 136.77,44.43 138.45,44.43 146.69,36.2 146.69,33.96 N.LED- 144.46,31.73 144.46,27.19 146.27,25.38 146.45,25.38 149.35,22.48 149.35,7.62 150.11,6.86 184.78,6.86 189.71,1.93 249.58,1.93 251.08,3.43 251.08,4.19 248.94,6.33 248.66,6.33 246.84,8.14 246.84,10.7 248.67,12.53 MENU.LED- | v101.73,36.58 101.73,35.05 101.35,34.67 101.35,34.54 101.33,34.52 101.33,22.49 104.01,19.81 104.01,16.38 102.87,15.24 102.11,15.24 101.73,14.86 101.73,9.91 103,8.64 IC1.5 | INS.LED- 298.63,103.17 300.61,105.16 311.66,105.16 v312.42,105.92 311.66,106.68 311.66,116.59 314.35,119.28 SCRLOCK.LED-
IC1-6  (via drill 0.35)
  Top 0.152: v238.12,106.3 237.74,105.92 67.06,105.92 v66.67,105.54 | IC1.6 97.41,8.76 76.58,8.76 70.48,2.67 49.53,2.67 48.51,3.68 48.51,14.35 50.16,16 57.15,16 58.17,14.99 LALT.LED-
  Bottom 0.152: F10.LED- 236.78,117.3 234.96,115.48 234.96,112.92 236.77,111.11 237.51,111.11 238.51,110.11 238.51,106.68 v238.12,106.3 237.74,105.92 221.74,105.92 216.03,100.2 199.64,100.2 198.5,99.06 198.5,91.44 198.68,91.26 0.LED- | F2.LED- 65.33,117.3 63.51,115.48 63.51,112.92 65.32,111.11 65.68,111.11 67.06,109.73 67.06,105.92 v66.67,105.54 65.91,104.78 47.24,104.78 46.1,103.63 46.1,90.88 2.LED- 46.28,88.73 44.46,86.9 44.46,84.34 46.27,82.53 46.63,82.53 55.8,73.36 W.LED- 55.8,69.68 53.98,67.85 53.98,65.29 55.79,63.48 56.91,63.48 60.58,59.82 S.LED- 60.58,51.82 58.67,49.91 58.67,48.37 58.71,48.33 58.71,46.29 60.57,44.43 60.73,44.43 62.1,43.05 62.1,41.53 X.LED- 70.08,31.58 68.26,29.75 68.26,26.99 72.01,23.24 72.01,21.34 69.72,19.05 60.58,19.05 58.17,16.64 LALT.LED-
IC1-7  (via drill 0.35)
  Top 0.152: v257.18,105.92 256.79,105.54 86.49,105.54 v86.11,105.16
  Bottom 0.152: C.LED- 89.13,33.15 | 89.13,33.15 89.13,31.58 87.31,29.75 87.31,27.19 89.12,25.38 89.68,25.38 91.06,24 91.06,16 91.59,15.47 91.59,4.42 92.58,3.43 97.16,3.43 97.92,4.19 IC1.7 100.58,3.05 122.68,3.05 123.83,4.19 123.83,12.57 125.75,14.5 SBAR.LED- | F11.LED- 255.83,117.3 254.01,115.48 254.01,112.92 255.82,111.11 256.56,111.11 257.56,110.11 257.56,106.3 v257.18,105.92 256.41,105.16 223.27,105.16 217.7,99.59 -.LED- | F3.LED- 84.38,117.3 82.56,115.48 82.56,112.92 84.37,111.11 84.73,111.11 86.11,109.73 v86.11,105.16 84.58,103.63 71.63,103.63 65.33,97.33 3.LED- 65.33,88.73 63.51,86.9 63.51,84.32 74.85,72.97 E.LED- 74.85,69.68 73.03,67.85 73.03,65.29 74.84,63.48 75.97,63.48 79.63,59.82 D.LED- 79.63,50.63 77.81,48.8 77.81,46.24 79.62,44.43 80.16,44.43 89.15,35.43 89.15,33.17 89.13,33.15
IC1-8  (via drill 0.35)
  Top 0.152: 260.22,104.01 329.18,104.01 v331.47,106.3 | 260.22,104.01 172.59,104.01 v172.21,103.63 | M.LED- 165.33,36.22 163.45,38.1 v99.06,38.1 | v260.22,103.63 260.22,104.01
  Bottom 0.152: F7.LED- 170.1,117.3 168.28,115.48 168.28,112.92 170.09,111.11 170.83,111.11 172.21,109.73 v172.21,103.63 164.21,103.63 163.07,102.49 141.73,102.49 141.53,102.29 7.LED- 141.53,88.73 139.71,86.9 139.71,84.34 141.52,82.53 142.26,82.53 151.05,73.74 U.LED- 151.05,69.68 149.23,67.85 149.23,65.27 155.83,58.67 J.LED- 155.83,50.63 154.01,48.8 154.01,46.24 155.82,44.43 156.36,44.43 165.33,35.46 M.LED- | v99.06,38.1 99.06,37.34 98.68,36.96 98.68,20.57 96.77,18.67 96.77,9.53 95.38,8.13 IC1.8 | HOME.LED- 317.68,103.94 319.66,105.92 331.09,105.92 v331.47,106.3 330.71,107.06 330.71,115.82 334.16,119.28 PAUSE.LED- | RCTRL.LED- 267.84,19.15 267.84,40.39 280.04,52.58 280.04,67.82 278.13,69.72 268.52,69.72 267.08,71.16 267.08,80.77 263.49,84.37 263.49,86.43 262.89,87.02 262.89,100.97 v260.22,103.63
IC1-10  (via drill 0.35)
  Top 0.152: v293.37,105.92 292.23,104.78 134.11,104.78 v133.73,104.39 | v88.01,18.67 90.3,20.95 129.16,20.95 v129.54,21.34 | v210.69,94.49 235.46,94.49 238.89,97.92 264.41,97.92 265.18,97.16 v265.56,97.16
  Bottom 0.152: v129.54,21.34 129.54,23.62 127.78,25.38 127.22,25.38 125.41,27.19 125.41,29.75 127.23,31.58 B.LED- 127.23,35.46 118.26,44.43 117.72,44.43 115.91,46.24 115.91,48.8 117.73,50.63 G.LED- 117.73,58.67 111.13,65.27 111.13,67.85 112.95,69.68 T.LED- 112.95,93.17 111.63,94.49 110.87,94.49 108.97,92.58 105.31,92.58 5.LED- 102.87,91.26 102.87,99.44 107.82,104.39 v133.73,104.39 134.11,104.78 134.11,109.73 132.73,111.11 131.99,111.11 130.18,112.92 130.18,115.48 132,117.3 F5.LED- | v88.01,18.67 88.01,16.38 89.15,15.24 89.15,6.86 IC1.10 | PRTSC.LED- 294.54,119.28 292.88,117.62 292.88,106.41 v293.37,105.92 291.08,103.63 266.7,103.63 265.56,102.49 v265.56,97.16 265.56,90.91 BKSPACE.LED- | RWIN.LED- 231.65,21.29 231.65,34.67 227.08,39.24 224.41,39.24 222.12,41.53 222.12,54.48 217.17,59.44 217.17,76.84 211.48,82.53 211.48,93.7 v210.69,94.49
IC1-11  (via drill 0.35)
  Top 0.152: v219.07,106.68 218.69,106.3 47.24,106.3 v46.86,105.92 | WIN.LED- 25.93,14.5 24.77,13.34 24.77,3.43 25.91,2.29 70.87,2.29 76.96,8.38 85.83,8.38 87.76,6.45 IC1.11
  Bottom 0.152: F9.LED- 217.73,117.3 215.91,115.48 215.91,112.92 217.72,111.11 218.46,111.11 219.46,110.11 219.46,107.06 v219.07,106.68 213.74,101.35 186.31,101.35 179.63,94.67 9.LED- | F1.LED- 46.28,117.3 44.46,115.48 44.46,112.92 46.27,111.11 46.63,111.11 47.62,110.11 47.62,106.68 v46.86,105.92 27.81,105.92 27.05,105.16 27.05,90.86 27.23,90.68 | 1.LED- 27.23,90.68 | 27.23,90.68 27.23,88.73 25.41,86.9 25.41,84.34 27.22,82.53 28.34,82.53 33.53,77.34 33.53,73.15 35.03,71.65 Q.LED- 36.75,69.68 34.93,67.85 34.93,65.27 41.53,58.67 A.LED- 41.53,50.63 39.71,48.8 39.71,46.24 41.52,44.43 42.44,44.43 51.03,35.84 Z.LED- 51.03,31.58 49.21,29.75 49.21,27.19 51.02,25.38 51.96,25.38 54.1,23.24 54.1,20.95 52.2,19.05 36.2,19.05 34.29,17.14 34.29,14.58 WIN.LED-
IC1-14  (1 unrouted)
  Top 0.152: LALT.LED+ 60.85,14.36 | 60.85,14.36 63.84,11.37 66.46,11.37 67.16,10.67 86.49,10.67 87.76,11.94 IC1.14 90.42,10.67 116.59,10.67 118.11,12.19 118.11,13.72 121.54,17.14 131.06,17.14 132.21,16 132.21,14.5 | WIN.LED+ 36.96,14.5 | 36.96,14.5 48.03,14.5 49.91,16.38 59.82,16.38 60.85,15.35 60.85,14.36 | LCTRL.LED+ 22.5,14.5 24.38,16.38 36.2,16.38 36.96,15.62 36.96,14.5 | 227.46,14.55 229.29,16.38 243.74,16.38 244.12,16.76 250.57,16.76 251.21,16.13 | 251.21,16.13 MENU.LED+ | 227.46,14.55 227.46,15.24 226.31,16.38 223.65,16.38 222.12,14.86 216.79,14.86 215.65,13.72 204.42,13.72 RALT.LED+ 203.63,15.8 203.64,15.81 202.69,16.76 194.21,16.76 190.3,12.85 133.81,12.85 SBAR.LED+ | 227.46,14.55 RWIN.LED+ | RCTRL.LED+ 275.03,16.05 274.3,16.79 251.87,16.79 251.21,16.13
IC1-15  (via drill 0.35)
  Top 0.152: ESC.LED+ 33.93,119.28 36.2,121.54 46.86,121.54 48.82,119.58 F1.LED+ 55.27,119.28 57.53,121.54 66.67,121.54 67.87,120.34 F2.LED+ 73.51,119.28 73.53,119.25 75.06,119.25 77.34,121.54 84.66,121.54 F3.LED+ 92.23,119.28 94.87,121.92 104.39,121.92 105.97,120.34 F4.LED+ 120.8,119.28 123.06,121.54 133.73,121.54 134.54,120.73 F5.LED+ 140.18,119.28 140.21,119.25 142.49,121.54 153.16,121.54 153.92,120.78 153.92,119.61 F6.LED+ 158.52,119.28 160.78,121.54 170.38,121.54 F7.LED+ | v88.01,39.24 v79.63,39.24
  Bottom 0.152: F3.LED+ 92.18,119.28 93.34,118.11 93.34,107.06 88.75,102.47 79.86,102.47 77.34,99.95 77.34,79.25 84.2,72.39 84.2,59.05 88.39,54.86 88.39,39.62 v88.01,39.24 | v79.63,39.24 81.92,36.96 81.92,22.48 84.2,20.19 89.15,20.19 89.92,19.43 89.92,15.62 90.3,15.24 IC1.15
IC1-16
  Top 0.152: X.LED+ 72.68,33.62 | 72.68,33.62 72.97,33.91 85.72,33.91 87.25,35.43 91.06,35.43 91.67,34.82 C.LED+ 92.43,34.31 104.04,34.31 105.16,35.43 109.73,35.43 110.72,34.44 V.LED+ 111.07,33.91 122.68,33.91 124.21,35.43 128.78,35.43 129.77,34.44 B.LED+ 143.88,33.55 145.33,32.11 148.21,32.11 148.82,32.72 N.LED+ 162.93,33.55 164.38,32.11 167.26,32.11 167.87,32.72 M.LED+ | Z.LED+ 53.72,33.55 53.72,33.93 | 53.72,33.93 65.56,33.93 67.06,35.43 72.01,35.43 72.68,34.76 72.68,33.62 | LSHIFT.LED+ 37.74,33.55 40.01,35.81 52.58,35.81 53.72,34.67 53.72,33.93
  Bottom 0.152: C.LED+ 95.61,33.55 97.88,31.28 97.88,24.85 93.98,20.95 92.71,20.95 92.08,20.32 92.08,15.88 92.71,15.24 92.71,13.46 | 92.58,13.59 92.71,13.46 | IC1.16 92.77,13.4 92.71,13.46
IC1-17